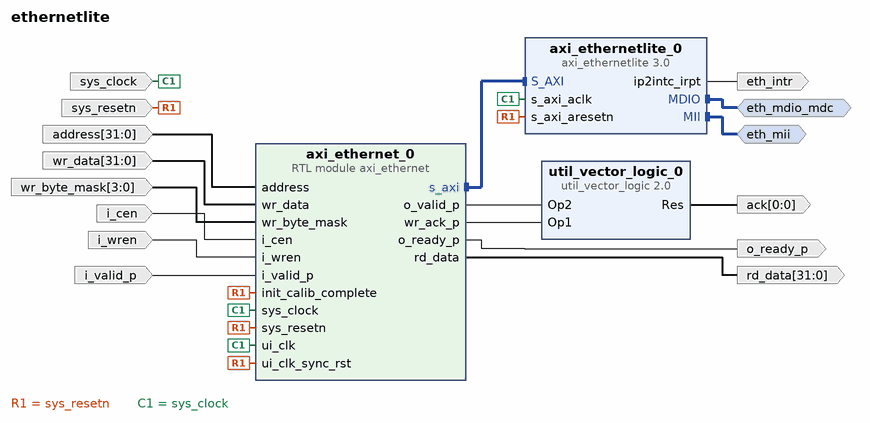
[diagram p0: block diagram of the top level]
# Vivado block design ethernetlite, xc7a35ticsg324-1L, Vivado 2020.1
create_bd_design ethernetlite

create_bd_intf_port -mode Master -vlnv xilinx.com:interface:mii_rtl:1.0 eth_mii
create_bd_intf_port -mode Master -vlnv xilinx.com:interface:mdio_rtl:1.0 eth_mdio_mdc
create_bd_port -dir I -type rst sys_resetn
create_bd_port -dir I -type clk sys_clock
create_bd_port -dir I -from 31 -to 0 address
create_bd_port -dir I -from 31 -to 0 wr_data
create_bd_port -dir I -from 3 -to 0 wr_byte_mask
create_bd_port -dir I i_cen
create_bd_port -dir I i_wren
create_bd_port -dir I i_valid_p
create_bd_port -dir O -from 31 -to 0 rd_data
create_bd_port -dir O o_ready_p
create_bd_port -dir O -type intr eth_intr
create_bd_port -dir O -from 0 -to 0 ack

create_bd_cell -type ip -vlnv xilinx.com:ip:axi_ethernetlite:3.0 axi_ethernetlite_0
set_property -dict [list \
  CONFIG.C_RX_PING_PONG 0 \
  CONFIG.C_S_AXI_PROTOCOL AXI4 \
  CONFIG.C_TX_PING_PONG 0 \
  CONFIG.MDIO_BOARD_INTERFACE eth_mdio_mdc \
  CONFIG.MII_BOARD_INTERFACE eth_mii \
  CONFIG.USE_BOARD_FLOW true \
] [get_bd_cells axi_ethernetlite_0]
create_bd_cell -type module -reference axi_ethernet axi_ethernet_0
create_bd_cell -type ip -vlnv xilinx.com:ip:util_vector_logic:2.0 util_vector_logic_0
set_property -dict {CONFIG.C_OPERATION or CONFIG.C_SIZE 1} [get_bd_cells util_vector_logic_0]

# ---- connections ----

connect_bd_intf_net [get_bd_intf_ports eth_mii] [get_bd_intf_pins axi_ethernetlite_0/MII]
connect_bd_intf_net [get_bd_intf_ports eth_mdio_mdc] [get_bd_intf_pins axi_ethernetlite_0/MDIO]
connect_bd_intf_net [get_bd_intf_pins axi_ethernet_0/s_axi] [get_bd_intf_pins axi_ethernetlite_0/S_AXI]
connect_bd_net -net sys_resetn_0_1 [get_bd_ports sys_resetn] \
  [get_bd_pins axi_ethernetlite_0/s_axi_aresetn] [get_bd_pins axi_ethernet_0/sys_resetn] \
  [get_bd_pins axi_ethernet_0/ui_clk_sync_rst] [get_bd_pins axi_ethernet_0/init_calib_complete]
connect_bd_net -net sys_clock_0_1 [get_bd_ports sys_clock] \
  [get_bd_pins axi_ethernetlite_0/s_axi_aclk] [get_bd_pins axi_ethernet_0/sys_clock] [get_bd_pins axi_ethernet_0/ui_clk]
connect_bd_net -net address_0_1 [get_bd_ports address] [get_bd_pins axi_ethernet_0/address]
connect_bd_net -net wr_data_0_1 [get_bd_ports wr_data] [get_bd_pins axi_ethernet_0/wr_data]
connect_bd_net -net wr_byte_mask_0_1 [get_bd_ports wr_byte_mask] [get_bd_pins axi_ethernet_0/wr_byte_mask]
connect_bd_net -net i_cen_0_1 [get_bd_ports i_cen] [get_bd_pins axi_ethernet_0/i_cen]
connect_bd_net -net i_wren_0_1 [get_bd_ports i_wren] [get_bd_pins axi_ethernet_0/i_wren]
connect_bd_net -net i_valid_p_0_1 [get_bd_ports i_valid_p] [get_bd_pins axi_ethernet_0/i_valid_p]
connect_bd_net [get_bd_pins axi_ethernet_0/rd_data] [get_bd_ports rd_data]
connect_bd_net [get_bd_pins axi_ethernet_0/o_ready_p] [get_bd_ports o_ready_p]
connect_bd_net [get_bd_pins axi_ethernetlite_0/ip2intc_irpt] [get_bd_ports eth_intr]
connect_bd_net [get_bd_pins axi_ethernet_0/o_valid_p] [get_bd_pins util_vector_logic_0/Op2]
connect_bd_net [get_bd_pins axi_ethernet_0/wr_ack_p] [get_bd_pins util_vector_logic_0/Op1]
connect_bd_net [get_bd_pins util_vector_logic_0/Res] [get_bd_ports ack]

# ---- address map ----
exclude_bd_addr_seg -offset 0x40E00000 -range 64K -target_address_space [get_bd_addr_spaces axi_ethernet_0/s_axi] [get_bd_addr_segs axi_ethernetlite_0/S_AXI/Reg]

validate_bd_design
save_bd_design
